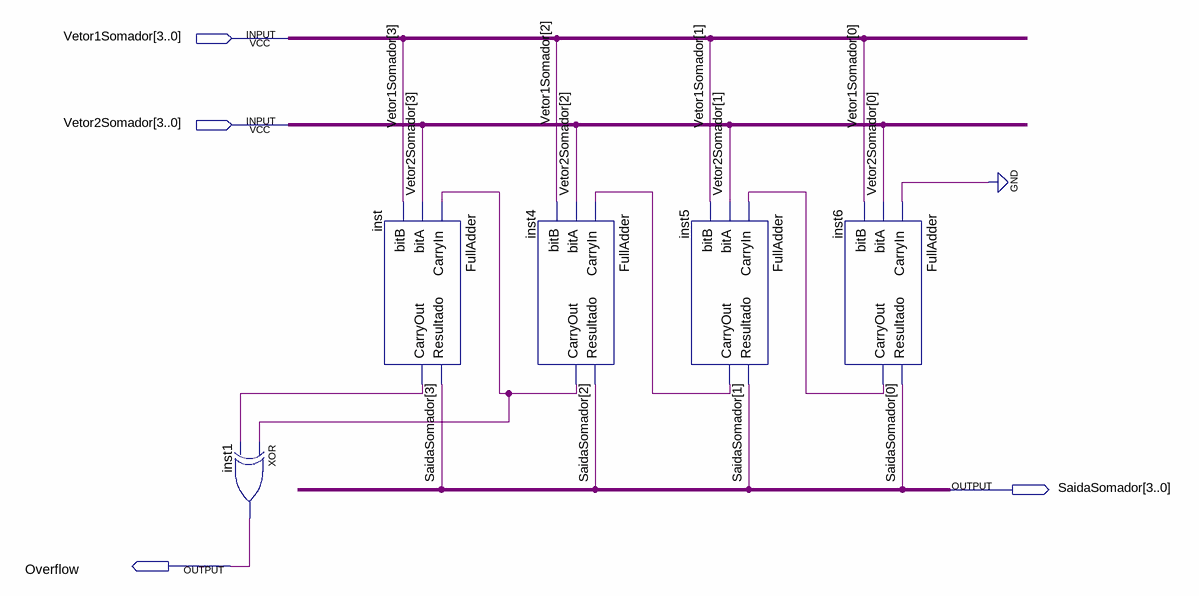
[diagram p0: schematic sheet]
// Quartus schematic Somador.bdf as structural Verilog: 5 symbols, 4 pins
module Somador (
  input  [3:0] Vetor1Somador,
  input  [3:0] Vetor2Somador,
  output [3:0] SaidaSomador,
  output Overflow
);

  wire inst4_carryout, inst5_carryout, inst6_carryout, inst_carryout;

  xor inst1 (Overflow, inst4_carryout, inst_carryout);
  FullAdder inst (
    .CarryIn(inst4_carryout), .bitA(Vetor2Somador[3]), .bitB(Vetor1Somador[3]), .Resultado(SaidaSomador[3]),
    .CarryOut(inst_carryout));
  FullAdder inst4 (
    .CarryIn(inst5_carryout), .bitA(Vetor2Somador[2]), .bitB(Vetor1Somador[2]), .Resultado(SaidaSomador[2]),
    .CarryOut(inst4_carryout));
  FullAdder inst5 (
    .CarryIn(inst6_carryout), .bitA(Vetor2Somador[1]), .bitB(Vetor1Somador[1]), .Resultado(SaidaSomador[1]),
    .CarryOut(inst5_carryout));
  FullAdder inst6 (
    .CarryIn(1'b0), .bitA(Vetor2Somador[0]), .bitB(Vetor1Somador[0]), .Resultado(SaidaSomador[0]),
    .CarryOut(inst6_carryout));
endmodule
